# EAGLE design Super Lucky Multi FPC (EAGLE 5.01)
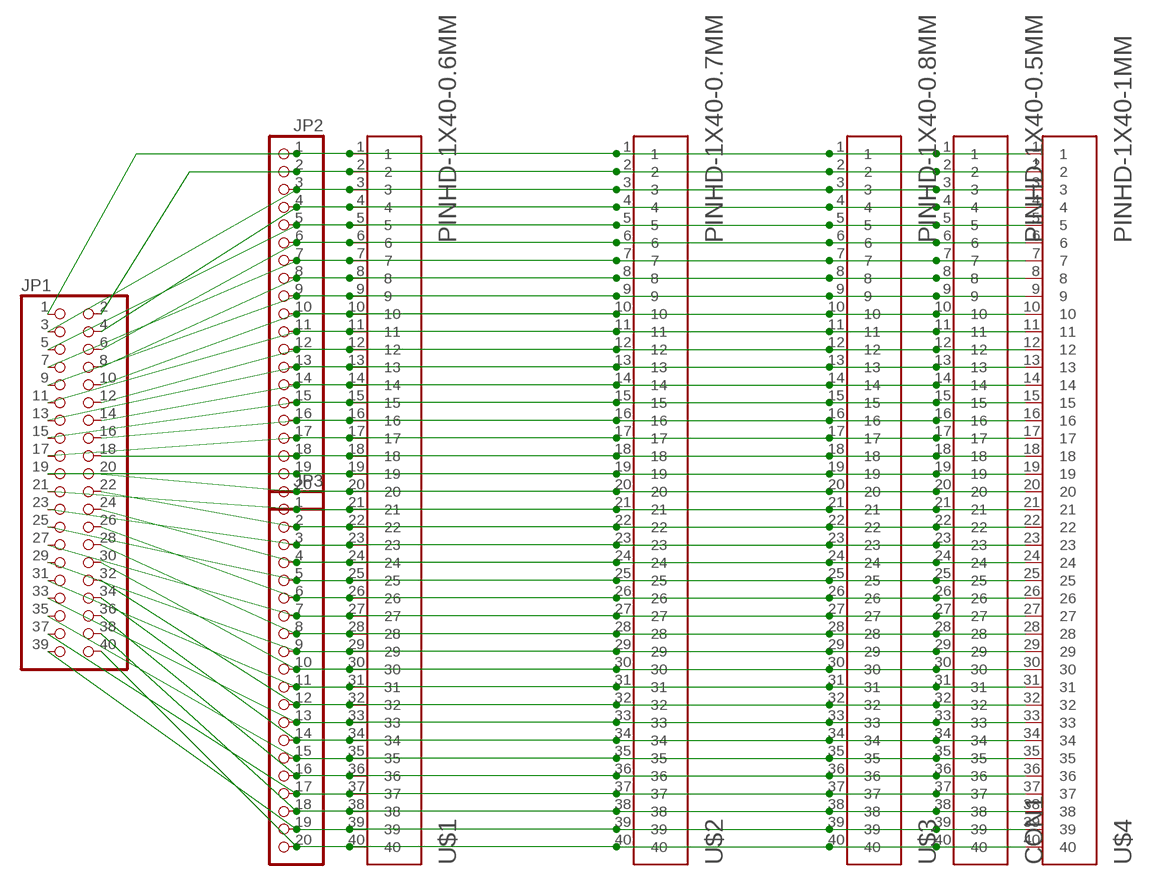
[diagram p0: schematic, sheet 1]

## Parts
CON1  PINHD-1X40-0.5MM  [1X40-0.5MM]
JP1  PINHD-2X20-BIG  [2X20-BIG]
JP2  PINHD-1X20-BIG  [1X20-BIG]
JP3  PINHD-1X20-BIG  [1X20-BIG]
U$1  PINHD-1X40-0.6MM  [1X40-0.6MM]
U$2  PINHD-1X40-0.7MM  [1X40-0.7MM]
U$3  PINHD-1X40-0.8MM  [1X40-0.8MM]
U$4  PINHD-1X40-1MM  [1X40-1MM]

## Nets
N$1: CON1.1 JP1.1 JP2.1 U$1.1 U$2.1 U$3.1 U$4.1
N$2: CON1.2 JP1.2 JP2.2 U$1.2 U$2.2 U$3.2 U$4.2
N$3: CON1.3 JP1.3 JP2.3 U$1.3 U$2.3 U$3.3 U$4.3
N$4: CON1.4 JP1.4 JP2.4 U$1.4 U$2.4 U$3.4 U$4.4
N$5: CON1.5 JP1.5 JP2.5 U$1.5 U$2.5 U$3.5 U$4.5
N$6: CON1.6 JP1.6 JP2.6 U$1.6 U$2.6 U$3.6 U$4.6
N$7: CON1.7 JP1.7 JP2.7 U$1.7 U$2.7 U$3.7 U$4.7
N$8: CON1.8 JP1.8 JP2.8 U$1.8 U$2.8 U$3.8 U$4.8
N$9: CON1.9 JP1.9 JP2.9 U$1.9 U$2.9 U$3.9 U$4.9
N$10: CON1.10 JP1.10 JP2.10 U$1.10 U$2.10 U$3.10 U$4.10
N$11: CON1.11 JP1.11 JP2.11 U$1.11 U$2.11 U$3.11 U$4.11
N$12: CON1.12 JP1.12 JP2.12 U$1.12 U$2.12 U$3.12 U$4.12
N$13: CON1.13 JP1.13 JP2.13 U$1.13 U$2.13 U$3.13 U$4.13
N$14: CON1.14 JP1.14 JP2.14 U$1.14 U$2.14 U$3.14 U$4.14
N$15: CON1.15 JP1.15 JP2.15 U$1.15 U$2.15 U$3.15 U$4.15
N$16: CON1.16 JP1.16 JP2.16 U$1.16 U$2.16 U$3.16 U$4.16
N$17: CON1.17 JP1.17 JP2.17 U$1.17 U$2.17 U$3.17 U$4.17
N$18: CON1.18 JP1.18 JP2.18 U$1.18 U$2.18 U$3.18 U$4.18
N$19: CON1.19 JP1.19 JP2.19 U$1.19 U$2.19 U$3.19 U$4.19
N$20: CON1.20 JP1.20 JP2.20 U$1.20 U$2.20 U$3.20 U$4.20
N$21: CON1.21 JP1.21 JP3.1 U$1.21 U$2.21 U$3.21 U$4.21
N$22: CON1.22 JP1.22 JP3.2 U$1.22 U$2.22 U$3.22 U$4.22
N$23: CON1.23 JP1.23 JP3.3 U$1.23 U$2.23 U$3.23 U$4.23
N$24: CON1.24 JP1.24 JP3.4 U$1.24 U$2.24 U$3.24 U$4.24
N$25: CON1.25 JP1.25 JP3.5 U$1.25 U$2.25 U$3.25 U$4.25
N$26: CON1.26 JP1.26 JP3.6 U$1.26 U$2.26 U$3.26 U$4.26
N$27: CON1.27 JP1.27 JP3.7 U$1.27 U$2.27 U$3.27 U$4.27
N$28: CON1.28 JP1.28 JP3.8 U$1.28 U$2.28 U$3.28 U$4.28
N$29: CON1.29 JP1.29 JP3.9 U$1.29 U$2.29 U$3.29 U$4.29
N$30: CON1.30 JP1.30 JP3.10 U$1.30 U$2.30 U$3.30 U$4.30
N$31: CON1.31 JP1.31 JP3.11 U$1.31 U$2.31 U$3.31 U$4.31
N$32: CON1.32 JP1.32 JP3.12 U$1.32 U$2.32 U$3.32 U$4.32
N$33: CON1.33 JP1.33 JP3.13 U$1.33 U$2.33 U$3.33 U$4.33
N$34: CON1.34 JP1.34 JP3.14 U$1.34 U$2.34 U$3.34 U$4.34
N$35: CON1.35 JP1.35 JP3.15 U$1.35 U$2.35 U$3.35 U$4.35
N$36: CON1.36 JP1.36 JP3.16 U$1.36 U$2.36 U$3.36 U$4.36
N$37: CON1.37 JP1.37 JP3.17 U$1.37 U$2.37 U$3.37 U$4.37
N$38: CON1.38 JP1.38 JP3.18 U$1.38 U$2.38 U$3.38 U$4.38
N$39: CON1.39 JP1.39 JP3.19 U$1.39 U$2.39 U$3.39 U$4.39
N$40: CON1.40 JP1.40 JP3.20 U$1.40 U$2.40 U$3.40 U$4.40

## Library data of the parts
CON1 U$1-U$4 = adafruit:PINHD-1X40: Pinouts for OLED/LCD displays with flex ribbons
JP1 = adafruit:PINHD-2X20: PIN HEADER
JP2 JP3 = adafruit:PINHD-1X20: PIN HEADER

## Board
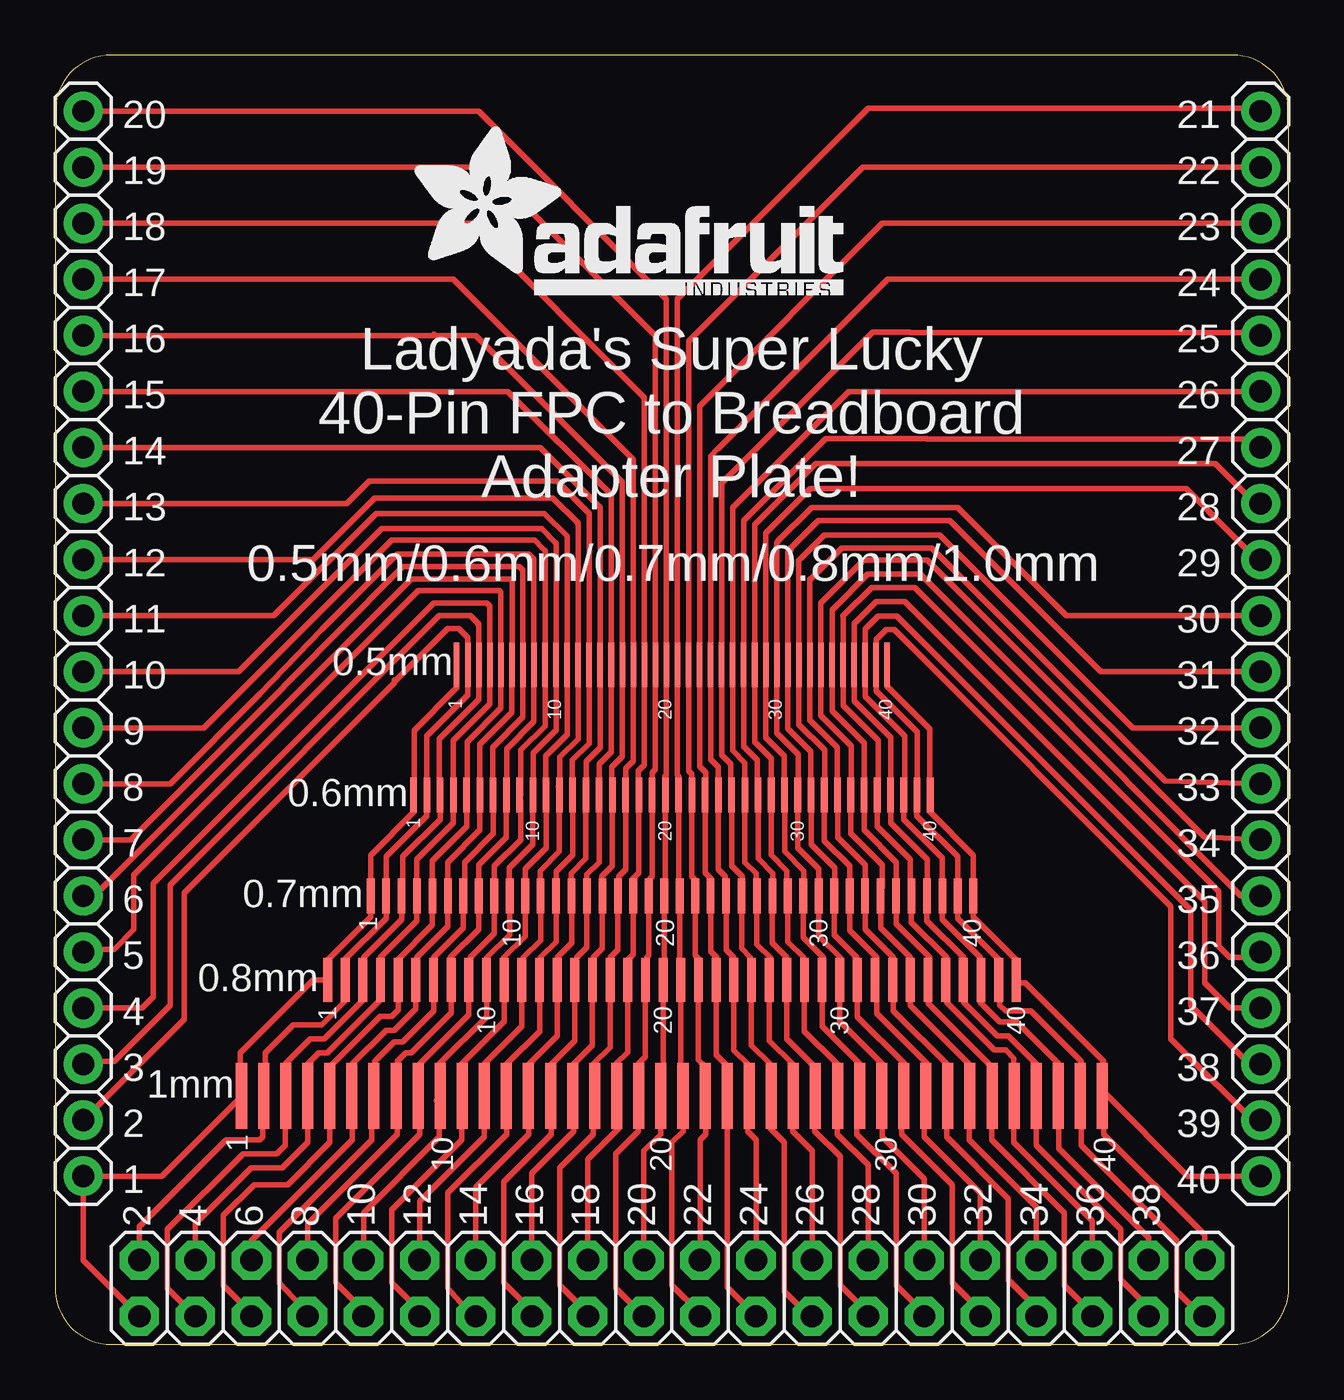
[diagram p1: board, top side]

Size 55.88 x 58.42 mm. Coordinates in mm from the lower left corner, seen from the top.
Outline: 0,55.88 0,2.54 arc90 2.54,0 53.34,0 arc90 55.88,2.54 55.88,55.88 arc90 53.34,58.42 2.54,58.42 arc90 0,55.88
Copper layers (1*16): Top 0.035mm / dielectric 1.5mm / Bottom 0.035mm
Design rules "default *": minimum track width 8mil, minimum drill 24mil, track to track 9mil, track to pad 8mil, pad to pad 8mil, via to via 8mil, smd to smd 8mil, copper to edge 10mil, drill to drill 8mil, minimum pad ring 10mil, minimum via ring 8mil, stop-mask expansion 4mil, vias tented up to drill 0mil, thermal gap 10mil

### Footprints (pad centres in the part's own frame; a part is rotated, then mirrored left to right if it is on the bottom)
1X40-0.5MM = smd 0.25 x 2: 1 -9.75,0; 2 -9.25,0; 3 -8.75,0; 4 -8.25,0; 5 -7.75,0; 6 -7.25,0; 7 -6.75,0; 8 -6.25,0; 9 -5.75,0; 10 -5.25,0; 11 -4.75,0; 12 -4.25,0; 13 -3.75,0; 14 -3.25,0; 15 -2.75,0; 16 -2.25,0; 17 -1.75,0; 18 -1.25,0; 19 -0.75,0; 20 -0.25,0; 21 0.25,0; 22 0.75,0; 23 1.25,0; 24 1.75,0; 25 2.25,0; 26 2.75,0; 27 3.25,0; 28 3.75,0; 29 4.25,0; 30 4.75,0; 31 5.25,0; 32 5.75,0; 33 6.25,0; 34 6.75,0; 35 7.25,0; 36 7.75,0; 37 8.25,0; 38 8.75,0; 39 9.25,0; 40 9.75,0
2X20-BIG = drill 1.016 pad 1.778 octagon: 1 -24.13,-1.27; 2 -24.13,1.27; 3 -21.59,-1.27; 4 -21.59,1.27; 5 -19.05,-1.27; 6 -19.05,1.27; 7 -16.51,-1.27; 8 -16.51,1.27; 9 -13.97,-1.27; 10 -13.97,1.27; 11 -11.43,-1.27; 12 -11.43,1.27; 13 -8.89,-1.27; 14 -8.89,1.27; 15 -6.35,-1.27; 16 -6.35,1.27; 17 -3.81,-1.27; 18 -3.81,1.27; 19 -1.27,-1.27; 20 -1.27,1.27; 21 1.27,-1.27; 22 1.27,1.27; 23 3.81,-1.27; 24 3.81,1.27; 25 6.35,-1.27; 26 6.35,1.27; 27 8.89,-1.27; 28 8.89,1.27; 29 11.43,-1.27; 30 11.43,1.27; 31 13.97,-1.27; 32 13.97,1.27; 33 16.51,-1.27; 34 16.51,1.27; 35 19.05,-1.27; 36 19.05,1.27; 37 21.59,-1.27; 38 21.59,1.27; 39 24.13,-1.27; 40 24.13,1.27
1X20-BIG = drill 1.016 pad 1.778: 1 -24.13,0; 2 -21.59,0; 3 -19.05,0; 4 -16.51,0; 5 -13.97,0; 6 -11.43,0; 7 -8.89,0; 8 -6.35,0; 9 -3.81,0; 10 -1.27,0; 11 1.27,0; 12 3.81,0; 13 6.35,0; 14 8.89,0; 15 11.43,0; 16 13.97,0; 17 16.51,0; 18 19.05,0; 19 21.59,0; 20 24.13,0
1X40-0.6MM = smd 0.3 x 1.6: 1 -11.7,0; 2 -11.1,0; 3 -10.5,0; 4 -9.9,0; 5 -9.3,0; 6 -8.7,0; 7 -8.1,0; 8 -7.5,0; 9 -6.9,0; 10 -6.3,0; 11 -5.7,0; 12 -5.1,0; 13 -4.5,0; 14 -3.9,0; 15 -3.3,0; 16 -2.7,0; 17 -2.1,0; 18 -1.5,0; 19 -0.9,0; 20 -0.3,0; 21 0.3,0; 22 0.9,0; 23 1.5,0; 24 2.1,0; 25 2.7,0; 26 3.3,0; 27 3.9,0; 28 4.5,0; 29 5.1,0; 30 5.7,0; 31 6.3,0; 32 6.9,0; 33 7.5,0; 34 8.1,0; 35 8.7,0; 36 9.3,0; 37 9.9,0; 38 10.5,0; 39 11.1,0; 40 11.7,0
1X40-0.7MM = smd 0.35 x 1.6: 1 -13.65,0; 2 -12.95,0; 3 -12.25,0; 4 -11.55,0; 5 -10.85,0; 6 -10.15,0; 7 -9.45,0; 8 -8.75,0; 9 -8.05,0; 10 -7.35,0; 11 -6.65,0; 12 -5.95,0; 13 -5.25,0; 14 -4.55,0; 15 -3.85,0; 16 -3.15,0; 17 -2.45,0; 18 -1.75,0; 19 -1.05,0; 20 -0.35,0; 21 0.35,0; 22 1.05,0; 23 1.75,0; 24 2.45,0; 25 3.15,0; 26 3.85,0; 27 4.55,0; 28 5.25,0; 29 5.95,0; 30 6.65,0; 31 7.35,0; 32 8.05,0; 33 8.75,0; 34 9.45,0; 35 10.15,0; 36 10.85,0; 37 11.55,0; 38 12.25,0; 39 12.95,0; 40 13.65,0
1X40-0.8MM = smd 0.4 x 2: 1 -15.6,0; 2 -14.8,0; 3 -14,0; 4 -13.2,0; 5 -12.4,0; 6 -11.6,0; 7 -10.8,0; 8 -10,0; 9 -9.2,0; 10 -8.4,0; 11 -7.6,0; 12 -6.8,0; 13 -6,0; 14 -5.2,0; 15 -4.4,0; 16 -3.6,0; 17 -2.8,0; 18 -2,0; 19 -1.2,0; 20 -0.4,0; 21 0.4,0; 22 1.2,0; 23 2,0; 24 2.8,0; 25 3.6,0; 26 4.4,0; 27 5.2,0; 28 6,0; 29 6.8,0; 30 7.6,0; 31 8.4,0; 32 9.2,0; 33 10,0; 34 10.8,0; 35 11.6,0; 36 12.4,0; 37 13.2,0; 38 14,0; 39 14.8,0; 40 15.6,0
1X40-1MM = smd 0.5 x 3: 1 -19.5,-0.17; 2 -18.5,-0.17; 3 -17.5,-0.17; 4 -16.5,-0.17; 5 -15.5,-0.17; 6 -14.5,-0.17; 7 -13.5,-0.17; 8 -12.5,-0.17; 9 -11.5,-0.17; 10 -10.5,-0.17; 11 -9.5,-0.17; 12 -8.5,-0.17; 13 -7.5,-0.17; 14 -6.5,-0.17; 15 -5.5,-0.17; 16 -4.5,-0.17; 17 -3.5,-0.17; 18 -2.5,-0.17; 19 -1.5,-0.17; 20 -0.5,-0.17; 21 0.5,-0.17; 22 1.5,-0.17; 23 2.5,-0.17; 24 3.5,-0.17; 25 4.5,-0.17; 26 5.5,-0.17; 27 6.5,-0.17; 28 7.5,-0.17; 29 8.5,-0.17; 30 9.5,-0.17; 31 10.5,-0.17; 32 11.5,-0.17; 33 12.5,-0.17; 34 13.5,-0.17; 35 14.5,-0.17; 36 15.5,-0.17; 37 16.5,-0.17; 38 17.5,-0.17; 39 18.5,-0.17; 40 19.5,-0.17

### Placement (x,y rotation side)
CON1  27.94,30.8 0 top
JP1  27.94,2.54 0 top
JP2  1.27,31.75 90 top
JP3  54.61,31.75 270 top
U$1  27.94,24.89 0 top
U$2  27.94,20.32 0 top
U$3  27.94,16.51 0 top
U$4  27.94,11.43 0 top
U$5  [ADAFRUIT_TEXT_20MM]  16.13,47.55 0 top

### Tracks (layer width: path | path; a pad name or v marks a point on that pad's centre or on a via)
N$1
  Top 0.254: U$2.1 14.29,19.37 12.32,17.4 12.32,16.64 12.34,16.62 U$3.1 11.68,16.51 8.38,13.21 8.38,11.18 | 16.24,24.11 U$1.1 16.26,24.91 16.26,27.81 18.11,29.67 | 14.29,20.01 U$2.1 | 8.38,11.18 8.38,11.05 8.44,11.11 U$4.1 8.44,11.23 8.38,11.18 | 16.24,24.11 16.26,24.13 | U$2.1 14.29,22.16 16.24,24.11 | 8.38,11.18 4.83,7.62 JP2.1 1.27,3.81 JP1.1 | 18.11,29.67 18.16,29.72 | CON1.1 18.19,29.75 18.11,29.67
N$2
  Top 0.254: 9.53,11.81 9.53,13.21 10.8,14.48 12.07,14.48 13.14,15.55 U$3.2 13.14,16.83 13.08,16.89 13.08,17.4 14.99,19.31 U$2.2 14.99,22.1 16.84,23.95 U$1.2 16.83,24.91 16.83,27.56 18.69,29.42 CON1.2 18.69,32.03 18.64,32.08 18.65,32.09 | 9.53,11.81 9.53,11.68 | JP1.2 3.81,5.33 7.75,9.27 9.27,9.27 9.4,9.4 9.4,11.3 | 9.4,11.3 | 9.4,11.3 U$4.2 | 9.53,11.81 9.4,11.81 9.4,11.3 | 15.4,30.07 17.78,32.45 18.29,32.45 18.65,32.09 | 15.4,30.07 15.37,30.04 | 18.65,32.09 18.67,32.07 | 18.65,32.09 | JP2.2 5.84,14.73 5.84,20.45 15.37,29.97 15.37,30.1 | 15.37,30.1 | 15.4,30.07 15.37,30.1
N$3
  Top 0.254: 13.94,16.48 13.84,16.38 | 13.94,16.48 U$3.3 13.94,15.59 12.19,13.84 11.56,13.84 10.41,12.7 10.41,11.29 | 13.94,16.48 13.97,16.51 13.97,17.53 15.69,19.25 U$2.3 15.75,20.32 15.75,22.1 17.44,23.79 U$1.3 17.4,24.93 17.4,27.43 19.19,29.22 CON1.3 19.19,32.6 19.15,32.64 19.18,32.64 18.8,33.02 17.4,33.02 5.21,20.83 5.21,15.37 2.67,12.83 1.4,12.83 JP2.3 | 10.44,11.28 U$4.3 10.41,11.29 | JP1.3 5.08,2.54 5.08,5.21 8.51,8.64 10.03,8.64 10.41,9.02 10.41,11.29 | 10.41,11.29 10.41,11.3
N$4
  Top 0.254: U$1.4 18.04,23.63 16.38,21.97 U$2.4 16.39,19.18 14.73,17.53 14.73,16.64 14.74,16.63 U$3.4 14.74,15.63 12.32,13.21 11.94,13.21 11.43,12.7 11.43,11.3 | 11.43,11.3 11.43,11.18 11.44,11.19 U$4.4 11.44,11.29 11.43,11.3 | 18.03,24.64 18.04,24.64 U$1.4 | JP1.4 6.35,5.46 8.89,8 10.29,8 11.43,9.14 11.43,11.3 | U$1.4 18.04,25.08 18.03,25.08 18.03,27.37 19.69,29.02 CON1.4 19.69,33.46 19.56,33.59 17.15,33.59 4.45,20.89 4.45,15.75 3.94,15.24 JP2.4
N$5
  Top 0.254: U$1.5 18.64,23.47 17.09,21.92 U$2.5 17.09,18.99 15.49,17.4 15.49,16.89 15.62,16.76 15.54,16.68 U$3.5 15.54,15.16 15.24,14.86 14.73,14.86 12.45,12.57 12.45,11.81 | 12.45,11.81 12.45,11.56 | 18.67,24.77 18.64,24.79 U$1.5 | JP1.5 8.89,1.4 7.62,2.67 7.62,5.84 9.02,7.24 10.54,7.24 12.45,9.14 U$4.5 | U$4.5 12.45,11.3 | U$4.5 12.44,11.8 12.45,11.81 | U$1.5 18.61,24.83 18.67,25.65 18.67,27.3 20.19,28.83 CON1.5 | CON1.5 20.19,30.61 | CON1.5 20.19,34.1 20.13,34.16 16.45,34.16 3.56,21.27 3.56,18.8 2.67,17.91 1.14,17.91 JP2.5
N$6
  Top 0.254: JP2.6 1.78,20.32 16.13,34.67 20.64,34.67 20.7,34.61 CON1.6 20.69,28.63 19.24,27.18 19.24,25.15 | JP1.6 8.89,4.7 13.46,9.27 13.46,11.18 13.38,11.26 | 13.38,11.26 13.34,11.3 | 13.38,11.26 U$4.6 13.44,11.32 13.34,11.43 13.46,11.56 13.46,12.7 14.99,14.22 15.37,14.22 16.34,15.2 U$3.6 16.34,16.59 16.38,16.64 16.38,17.53 17.79,18.93 U$2.6 17.79,20.69 17.78,20.7 17.78,21.84 19.24,23.3 U$1.6 19.24,25.15 | 19.24,25.15
N$7
  Top 0.254: U$3.7 | U$3.7 17.15,17.53 18.49,18.87 U$2.7 18.49,20.52 18.54,20.57 18.54,21.84 19.84,23.14 U$1.7 19.81,24.92 19.81,27.05 21.19,28.43 CON1.7 21.19,35.1 21.03,35.26 15.8,35.26 15.79,35.24 15.75,35.24 12.64,32.13 9.59,29.02 3.43,22.86 JP2.7 | U$3.7 17.15,15.11 15.75,13.72 15.37,13.72 14.48,12.83 14.48,11.56 | 14.48,11.56 14.48,11.05 14.44,11.09 U$4.7 14.44,11.52 14.48,11.56 | JP1.7 11.43,1.4 10.16,2.79 10.16,5.08 14.35,9.27 14.35,11.43 14.48,11.56
N$8
  Top 0.254: 20.44,24.26 20.44,22.98 19.18,21.72 19.18,20.45 19.19,20.43 U$2.8 19.19,18.81 17.91,17.53 17.91,16.76 17.94,16.73 U$3.8 17.94,15.02 16.13,13.21 15.88,13.21 15.49,12.83 15.49,11.56 15.37,11.43 15.44,11.36 U$4.8 15.41,11.26 | U$1.8 20.44,24.26 | JP2.8 5.21,25.4 9.27,29.46 12.07,32.38 15.49,35.81 21.46,35.81 21.59,35.69 21.69,35.59 CON1.8 21.69,28.23 20.45,26.99 U$1.8 | 20.44,24.26 20.45,24.26 | JP1.8 11.43,5.46 15.49,9.53 15.49,11.18 15.41,11.26 | 15.41,11.26 15.37,11.3 | 20.45,24.83 U$1.8
N$9
  Top 0.254: U$1.9 21.04,24.68 21.08,24.64 21.08,22.86 19.89,21.67 U$2.9 19.89,18.62 18.8,17.53 18.8,16.51 U$3.9 18.74,14.93 16.51,12.7 16.51,11.56 16.38,11.43 16.44,11.37 U$4.9 16.47,11.26 16.51,11.3 16.51,9.53 12.7,5.71 12.7,2.79 13.97,1.52 JP1.9 | U$1.9 21.08,24.89 | U$1.9 21.04,24.91 21.08,24.95 21.08,26.92 22.19,28.03 CON1.9 22.19,35.98 22.07,36.09 21.72,36.45 15.24,36.45 6.73,27.94 JP2.9
N$10
  Top 0.254: JP1.10 13.97,5.97 17.4,9.4 17.4,10.92 17.27,11.05 17.44,11.22 U$4.10 17.44,11.34 17.53,11.43 17.4,11.56 17.4,12.7 19.54,14.84 U$3.10 19.54,16.87 19.56,16.89 19.56,17.53 20.59,18.56 U$2.10 20.59,20.43 20.57,20.45 20.57,21.59 21.64,22.66 U$1.10 21.64,24.94 21.65,24.95 21.65,26.8 22.69,27.83 CON1.10 22.69,36.29 22.63,36.35 22.64,36.35 | JP2.10 8.32,30.48 14.8,36.96 22.04,36.96 22.64,36.35 | 22.64,36.35 22.67,36.32 | 22.64,36.35
N$11
  Top 0.254: 0.76,33.02 JP2.11 9.91,33.02 14.54,37.66 22.16,37.66 23.18,36.64 23.16,36.63 23.19,36.6 CON1.11 23.19,27.63 22.23,26.67 22.23,24.91 U$1.11 22.24,22.49 21.29,21.54 U$2.11 21.29,18.5 20.32,17.53 20.32,16.53 U$3.11 20.34,14.62 18.41,12.7 18.41,11.18 18.44,11.2 U$4.11 18.44,10.95 18.41,10.92 18.41,9.27 15.24,6.1 15.24,2.79 16.51,1.52 JP1.11
N$12
  Top 0.254: JP2.12 1.27,35.43 1.4,35.31 1.65,35.56 11.68,35.56 14.48,38.35 22.54,38.35 23.69,37.21 23.65,37.21 23.69,37.17 23.69,30.86 CON1.12 23.69,27.44 22.86,26.61 22.86,25.34 22.8,25.27 22.84,25.23 U$1.12 22.84,22.33 21.97,21.46 21.97,20.32 U$2.12 21.99,18.31 21.21,17.53 21.21,16.76 21.14,16.7 U$3.12 21.14,14.41 19.43,12.7 19.43,11.56 19.44,11.55 U$4.12 19.44,11.19 19.3,11.05 19.43,10.92 19.43,9.4 16.51,6.48 JP1.12
N$13
  Top 0.254: JP2.13 1.4,38.1 1.52,38.23 1.65,38.1 13.21,38.1 14.22,39.12 22.73,39.12 24.19,37.66 24.19,30.73 24.19,30.74 CON1.13 24.19,27.24 23.43,26.48 23.43,25.02 23.44,25.01 U$1.13 23.44,22.17 22.69,21.42 U$2.13 22.69,18.24 21.97,17.53 21.97,16.76 21.94,16.73 U$3.13 21.94,14.19 20.45,12.7 20.45,11.18 20.44,11.18 U$4.13 20.44,11.06 20.45,11.05 20.45,9.53 17.78,6.86 17.78,2.54 18.92,1.27 JP1.13
N$14
  Top 0.254: 1.27,40.39 1.14,40.26 | 1.27,40.39 JP2.14 | 1.27,40.39 1.52,40.64 21.97,40.64 24.7,37.91 24.7,30.86 24.69,30.85 CON1.14 24.69,27.04 24.07,26.42 24.07,24.92 U$1.14 24.04,22.01 23.37,21.34 23.37,20.7 23.39,20.68 U$2.14 23.39,18.18 22.73,17.53 22.73,16.64 22.74,16.63 U$3.14 22.74,13.98 21.34,12.57 21.34,11.05 21.44,11.15 U$4.14 21.44,10.9 21.34,10.79 21.46,10.67 21.46,9.53 19.05,7.11 JP1.14
N$15
  Top 0.254: 1.02,43.18 JP2.15 | 1.02,43.18 0.89,43.05 | JP1.15 21.59,1.52 20.32,2.79 20.32,7.37 22.48,9.53 22.48,10.92 22.35,11.05 22.44,11.14 U$4.15 22.48,11.3 22.35,11.43 22.35,12.57 23.54,13.76 U$3.15 23.5,16.51 23.62,16.64 23.62,17.53 24.09,17.99 U$2.15 24.09,21.3 24.64,21.85 U$1.15 24.64,24.95 24.64,26.29 25.19,26.84 CON1.15 25.19,38.5 20.51,43.18 1.02,43.18
N$16
  Top 0.254: JP2.16 1.4,45.72 1.52,45.85 1.65,45.72 17.15,45.72 17.15,45.78 17.21,45.72 19.05,45.72 25.69,39.08 CON1.16 25.69,26.64 25.21,26.16 25.21,25.21 25.27,25.15 25.24,25.11 U$1.16 25.24,21.68 24.77,21.21 24.77,20.57 24.79,20.55 U$2.16 24.79,17.93 24.38,17.53 24.38,16.64 24.34,16.59 U$3.16 24.34,13.54 23.5,12.7 23.5,11.3 23.45,11.26 U$4.16 23.44,11.23 23.5,11.18 23.5,9.65 21.59,7.75 JP1.16
N$17
  Top 0.254: 24.38,11.3 24.38,11.18 24.44,11.23 U$4.17 24.43,11.26 24.38,11.3 | 24.38,11.3 24.38,12.7 25.14,13.46 U$3.17 25.14,16.63 25.15,16.64 25.15,17.53 25.49,17.87 U$2.17 25.49,20.41 25.53,20.45 25.53,21.21 25.84,21.52 U$1.17 25.85,26.1 26.19,26.44 CON1.17 26.19,40.1 18.03,48.26 1.65,48.26 1.27,47.88 JP2.17 | JP1.17 24.13,1.4 22.86,2.67 22.86,8 24.38,9.53 24.38,11.3
N$18
  Top 0.254: JP2.18 1.4,50.93 1.52,50.8 18.8,50.8 26.69,42.91 CON1.18 26.69,26.25 26.42,25.97 26.42,25.15 26.44,25.12 U$1.18 26.44,21.36 26.16,21.08 26.16,20.19 26.19,20.22 U$2.18 26.19,17.68 25.91,17.4 25.91,16.38 25.94,16.41 U$3.18 25.94,13.24 25.4,12.7 25.4,11.68 25.44,11.64 U$4.18 25.44,11.09 25.4,11.05 25.53,10.92 25.53,9.78 24.13,8.38 JP1.18
N$19
  Top 0.254: 26.42,11.43 26.42,10.92 26.44,10.95 U$4.19 26.44,11.41 26.42,11.43 | 26.42,11.43 26.42,12.7 26.74,13.02 U$3.19 26.74,16.71 26.8,16.76 26.8,17.53 26.89,17.62 U$2.19 26.89,20.54 26.92,20.57 26.92,21.08 27.04,21.2 U$1.19 27.05,24.9 27.05,25.91 27.19,26.05 CON1.19 27.19,45.71 19.56,53.34 JP2.19 1.02,53.59 | JP1.19 25.4,2.54 25.4,8.64 26.42,9.65 26.42,11.43
N$20
  Top 0.254: 27.43,11.18 27.43,12.19 27.54,12.3 U$3.20 27.54,16.74 27.59,16.8 U$2.20 27.59,20.67 27.56,20.7 27.64,20.78 U$1.20 27.64,25.13 27.62,25.15 27.62,25.73 27.69,25.8 CON1.20 27.69,47.37 27.62,47.43 | JP2.20 1.52,56.13 1.78,55.88 19.18,55.88 27.62,47.43 | JP1.20 26.67,8.76 27.43,9.53 27.43,11.18 | 27.43,11.18 27.44,11.18 U$4.20 | 27.62,47.43 27.64,47.42
N$21
  Top 0.254: 28.32,47.5 28.24,47.42 | 28.32,47.5 36.83,56.01 54.36,56.01 54.48,56.13 54.61,56.01 JP3.1 | JP1.21 29.21,1.4 27.94,2.67 27.94,9.14 28.45,9.65 28.45,10.92 28.32,11.05 28.44,11.17 U$4.21 28.44,11.55 28.45,11.56 28.34,11.66 U$3.21 28.29,16.51 U$2.21 28.29,20.67 28.32,20.7 28.24,20.78 U$1.21 28.24,24.91 28.19,24.95 28.26,25.02 28.26,25.73 28.19,25.8 CON1.21 28.19,47.37 28.32,47.5
N$22
  Top 0.254: 28.85,45.62 36.58,53.34 JP3.2 54.86,53.34 | 54.86,53.34 55.12,53.34 55.25,53.47 54.99,53.47 54.86,53.34 | JP1.22 29.21,9.27 29.46,9.53 29.46,10.79 29.34,10.92 29.44,11.03 U$4.22 29.44,11.41 29.46,11.43 29.46,12.57 29.14,12.9 U$3.22 29.14,16.57 29.21,16.64 29.21,17.4 28.99,17.62 U$2.22 28.99,20.54 28.96,20.57 28.96,21.08 28.84,21.2 U$1.22 28.84,25.33 28.83,25.34 28.83,25.84 28.69,25.98 CON1.22 28.69,45.45 28.85,45.62 | 28.85,45.62 28.84,45.6
N$23
  Top 0.254: U$4.23 30.48,11.3 30.48,12.57 29.94,13.11 U$3.23 29.94,16.73 29.97,16.76 29.97,17.53 29.69,17.81 U$2.23 29.72,20.32 29.72,21.08 29.44,21.36 U$1.23 29.46,24.92 29.46,25.91 29.19,26.18 CON1.23 29.19,42.52 37.47,50.8 JP3.3 54.74,50.8 | U$4.23 | 54.74,50.8 54.74,50.67 54.86,50.67 54.74,50.8 | U$4.23 30.44,2.58 JP1.23
N$24
  Top 0.254: JP3.4 37.72,48.26 30.04,40.58 30.02,40.58 29.69,40.26 CON1.24 29.69,26.51 30.04,26.16 30.04,25.02 30.04,25.01 U$1.24 30.04,21.52 30.35,21.21 30.35,20.7 30.39,20.66 U$2.24 30.39,17.87 30.73,17.53 30.73,16.64 30.74,16.63 U$3.24 30.74,13.33 31.37,12.7 31.37,11.3 31.41,11.26 U$4.24 31.44,11.25 31.37,11.18 31.37,9.65 31.75,9.27 JP1.24 | JP3.4 54.74,48.26 55.25,47.75 54.61,47.75 54.48,47.88 54.61,48.01 JP3.4
N$25
  Top 0.254: JP3.5 54.48,45.59 54.23,45.85 38.73,45.85 38.71,45.87 37.03,45.87 30.19,39.03 CON1.25 30.19,26.71 30.61,26.29 30.61,24.89 U$1.25 30.64,21.68 31.12,21.21 31.12,20.34 U$2.25 31.09,17.93 31.5,17.53 31.5,16.76 31.54,16.72 U$3.25 31.54,13.54 32.39,12.7 32.39,11.18 32.44,11.23 U$4.25 32.44,10.98 32.39,10.92 32.39,9.78 33.02,9.14 33.02,2.41 34.16,1.27 JP1.25
N$26
  Top 0.254: 33.4,11.56 33.4,11.43 33.53,11.3 33.48,11.26 U$4.26 33.44,11.52 33.4,11.56 | 33.4,11.56 33.4,12.7 32.34,13.76 U$3.26 32.34,16.59 32.39,16.64 32.39,17.53 31.79,18.12 U$2.26 31.79,20.53 31.75,20.57 31.75,21.34 31.24,21.85 U$1.26 31.24,25.02 31.24,26.35 30.69,26.91 CON1.26 30.69,37.93 35.94,43.18 39.6,43.18 | 54.74,43.18 JP3.6 39.6,43.18 | 39.6,43.18 39.37,43.18 | JP1.26 34.29,8.76 33.4,9.65 33.4,11.56
N$27
  Top 0.254: U$1.27 31.84,22.01 32.51,21.34 32.51,20.34 U$2.27 32.49,18.18 33.15,17.53 33.15,16.64 33.14,16.63 U$3.27 33.14,13.85 34.42,12.57 34.42,11.3 34.46,11.26 | 34.46,11.26 34.54,11.18 | 34.46,11.26 U$4.27 34.44,11.07 34.29,10.92 34.42,10.79 34.42,9.65 35.56,8.51 35.56,2.67 36.83,1.4 JP1.27 | JP3.7 54.23,41.02 39.5,41.02 39.47,41.05 34.9,41.05 31.19,37.34 CON1.27 31.19,27.1 31.81,26.48 31.81,24.89 U$1.27 | JP3.7 54.99,40.26 54.99,40.39 54.61,40.77 JP3.7 | U$1.27 31.84,24.98
N$28
  Top 0.254: 35.39,11.26 35.31,11.18 | 35.39,11.26 U$4.28 35.44,11.06 35.31,10.92 35.43,10.79 35.43,9.53 36.83,8.13 JP1.28 | 35.39,11.26 35.43,11.3 35.43,12.7 33.94,14.19 U$3.28 33.94,16.86 33.91,16.89 33.91,17.53 33.19,18.24 U$2.28 33.15,20.36 33.15,21.46 32.44,22.17 U$1.28 32.45,26.54 31.69,27.3 CON1.28 31.69,37.15 34.44,39.9 52.55,39.9 54.46,38 54.56,38.1 JP3.8 | 53.85,38.23 54.1,37.97 54.61,37.97 JP3.8 | JP3.8 54.61,37.95 54.59,37.92 54.05,38.46
N$29
  Top 0.254: 54.23,35.56 54.36,35.43 54.48,35.56 JP3.9 54.61,35.48 54.56,35.43 52.46,37.53 | JP1.29 39.37,1.4 38.1,2.67 38.1,7.75 36.32,9.53 36.32,11.05 36.44,11.17 U$4.29 36.53,11.26 36.58,11.3 36.45,11.43 36.45,12.7 34.74,14.41 U$3.29 34.74,16.58 34.8,16.64 34.8,17.53 33.89,18.43 U$2.29 33.89,20.55 33.91,20.57 33.91,21.46 33.04,22.33 U$1.29 33.02,24.91 33.02,26.67 32.19,27.5 CON1.29 32.19,36.76 34.21,38.79 51.23,38.79 52.48,37.54 52.46,37.53 | 52.46,37.53 52.22,37.77
N$30
  Top 0.254: 54.99,33.02 JP3.10 45.8,33.02 40.89,37.92 34.27,37.92 32.74,36.4 32.77,36.4 32.69,36.32 CON1.30 32.69,27.7 33.66,26.73 33.66,24.95 33.64,24.94 U$1.30 33.64,22.49 34.59,21.54 U$2.30 34.59,18.5 35.56,17.53 35.56,16.64 35.54,16.62 U$3.30 35.54,14.62 37.47,12.7 37.47,11.18 37.44,11.2 U$4.30 37.44,11.02 37.34,10.92 37.47,10.79 37.47,9.4 39.37,7.49 JP1.30
N$31
  Top 0.254: U$1.31 34.24,22.66 35.31,21.59 35.31,20.7 35.29,20.69 U$2.31 35.29,18.56 36.32,17.53 36.32,16.51 U$3.31 36.34,14.84 38.48,12.7 38.48,11.68 | 38.44,11.01 38.35,10.92 | 38.44,11.01 U$4.31 38.44,11.64 38.48,11.68 | 38.48,11.68 38.48,11.05 38.44,11.01 | U$1.31 34.24,24.97 | JP1.31 41.91,1.52 40.64,2.79 40.64,7.24 38.35,9.53 38.35,11.56 38.48,11.68 | U$1.31 34.24,24.94 34.23,24.95 34.23,26.86 33.19,27.9 CON1.31 33.19,35.88 33.35,36.04 33.31,36.08 | JP3.11 47.37,30.48 40.51,37.34 34.57,37.34 33.31,36.08 | 33.31,36.08 33.22,35.99
N$32
  Top 0.254: 37.21,16.51 U$3.32 | 37.21,16.51 37.21,17.53 35.99,18.75 U$2.32 35.99,21.67 34.84,22.82 U$1.32 34.86,24.91 34.86,26.92 33.69,28.09 CON1.32 33.69,35.54 33.83,35.69 33.84,35.67 | 37.21,16.51 37.21,14.99 39.5,12.7 39.5,11.43 | 39.37,11.3 39.41,11.26 U$4.32 39.44,11.37 39.5,11.43 | JP1.32 41.91,6.86 39.37,9.4 39.37,11.3 | 39.37,11.3 39.5,11.43 | JP3.12 48.82,27.94 40.08,36.68 34.85,36.68 33.84,35.67 | 33.84,35.67 33.78,35.61
N$33
  Top 0.254: 37.97,16.51 U$3.33 | 37.97,16.51 37.97,17.53 36.69,18.81 U$2.33 36.7,20.32 36.7,21.72 35.44,22.98 U$1.33 35.43,27.05 34.19,28.29 CON1.33 | 37.97,16.51 37.97,15.11 40.51,12.57 40.51,10.79 40.44,10.87 U$4.33 40.44,10.98 40.39,10.92 40.39,9.4 43.18,6.6 43.18,2.92 44.45,1.65 JP1.33 | JP3.13 50.29,25.53 49.28,26.54 45.97,29.82 39.7,36.09 35.64,36.09 34.28,34.73 | CON1.33 | 34.28,34.73 34.19,34.65 | 34.28,34.73 34.27,34.75 34.19,34.67 CON1.33
N$34
  Top 0.254: U$1.34 36.04,23.14 37.47,21.72 37.47,20.7 37.34,20.57 37.39,20.52 U$2.34 37.39,18.87 38.73,17.53 U$3.34 | U$3.34 | U$3.34 38.73,15.37 41.53,12.57 41.53,11.56 41.4,11.43 41.44,11.39 U$4.34 41.44,11.34 | 36.07,24.77 36.04,24.79 U$1.34 | JP1.34 44.45,6.22 41.4,9.27 41.4,11.3 41.44,11.34 | 41.44,11.34 41.53,11.43 | U$1.34 36.07,24.89 36.07,27.12 34.69,28.49 CON1.34 34.69,33.6 34.75,33.66 | JP3.14 52.05,22.99 39.5,35.53 36.63,35.53 34.75,33.66 | 34.75,33.66 34.72,33.63
N$35
  Top 0.254: U$1.35 36.64,23.3 38.1,21.84 U$2.35 38.09,19.06 39.62,17.53 39.62,16.64 39.54,16.55 U$3.35 39.54,15.45 42.42,12.57 42.42,11.56 | 42.42,11.56 42.42,11.18 42.44,11.2 U$4.35 42.44,11.54 42.42,11.56 | U$1.35 36.64,24.83 | JP1.35 46.99,1.4 45.72,2.67 45.72,5.97 42.42,9.27 42.42,11.56 | U$1.35 | U$1.35 36.64,27.24 35.19,28.69 CON1.35 35.19,33.28 35.28,33.38 | JP3.15 53.7,20.32 52.22,21.79 44.86,29.23 39.19,34.9 36.8,34.9 35.28,33.38 | 35.28,33.38 35.26,33.35
N$36
  Top 0.254: 40.39,16.51 U$3.36 | 40.39,16.51 40.39,17.53 38.79,19.12 U$2.36 38.79,20.65 38.73,20.7 38.73,21.97 37.24,23.47 U$1.36 37.24,24.86 | 40.39,16.51 40.39,15.49 42.55,13.34 43.05,13.34 43.43,12.95 43.43,11.43 | 43.43,11.43 43.31,11.3 43.35,11.26 U$4.36 43.44,11.42 43.43,11.43 | JP1.36 46.99,5.59 43.43,9.14 43.43,11.43 | 37.24,24.86 37.21,24.83 | 37.24,24.86 37.28,24.89 37.28,27.37 35.69,28.95 CON1.36 35.69,32.99 36.98,34.29 38.94,34.29 52.7,20.52 52.7,18.03 53.21,17.53 54.48,17.53 54.48,17.65 JP3.16
N$37
  Top 0.254: U$1.37 37.84,23.63 39.5,21.97 39.5,20.45 39.49,20.44 U$2.37 39.49,19.18 41.15,17.53 41.15,16.38 | 41.15,16.38 41.14,16.39 U$3.37 | 41.15,16.38 41.15,15.49 42.67,13.97 43.18,13.97 44.45,12.7 44.45,11.43 44.44,11.42 U$4.37 44.44,11.19 44.45,11.18 44.45,9.02 48.26,5.21 48.26,2.92 49.53,1.65 JP1.37 | U$1.37 37.84,24.76 37.85,24.77 | U$1.37 37.84,25.01 37.85,25.02 37.85,27.5 36.19,29.15 CON1.37 36.19,32.66 37.19,33.66 38.48,33.66 52.07,20.07 52.07,16.38 53.21,15.24 JP3.17
N$38
  Top 0.254: 41.91,16.38 41.94,16.41 U$3.38 | 41.91,16.38 41.91,17.53 40.19,19.25 U$2.38 40.19,22.04 38.44,23.79 U$1.38 38.44,24.91 38.48,24.95 38.48,27.56 36.69,29.35 CON1.38 36.69,32.4 36.73,32.44 | 41.91,16.38 41.91,15.49 42.8,14.61 43.56,14.61 45.47,12.7 45.47,11.18 45.44,11.2 U$4.38 45.44,11.07 45.47,11.05 45.47,8.89 49.53,4.83 JP1.38 | 36.73,32.44 37.29,32.99 38.12,32.99 51.44,19.69 51.44,15.37 54.1,12.7 JP3.18 54.86,12.7 | 36.73,32.44 36.7,32.41
N$39
  Top 0.254: 42.8,16.51 U$3.39 | 42.8,16.51 42.8,17.4 40.89,19.31 U$2.39 40.89,22.1 39.04,23.95 U$1.39 39.05,24.91 39.05,27.75 37.19,29.61 CON1.39 | 42.8,16.51 42.8,15.37 43.05,15.11 44.2,15.11 46.48,12.83 46.48,11.56 46.44,11.52 U$4.39 46.44,11.09 46.48,11.05 46.48,9.02 50.8,4.7 50.8,2.41 51.94,1.27 JP1.39 | CON1.39 37.17,30.8 | CON1.39 37.19,31.93 37.64,32.38 38,32.38 50.55,19.84 50.55,13.84 54.74,9.65 54.74,10.03 JP3.19
N$40
  Top 0.254: 39.64,24.11 U$1.40 39.62,24.89 39.62,27.88 37.69,29.81 CON1.40 | 43.56,16.38 43.54,16.4 U$3.40 | 43.56,16.38 43.56,17.4 41.59,19.37 U$2.40 41.59,22.16 39.64,24.11 | 39.64,24.11 39.62,24.13 | 43.56,16.38 43.94,16.38 47.5,12.83 47.5,11.43 | 47.5,11.18 47.5,11.43 | 47.5,11.43 47.44,11.37 U$4.40 47.44,11.23 47.5,11.18 | JP3.20 51.31,7.62 47.5,11.43 | JP1.40 52.07,4.95 47.5,9.53 47.5,11.18

### Text on the board
tPlace: 20 | 21 | 19 | 22 | 18 | 23 | 17 | 24 | 16 | 25 | 15 | 26 | Ladyada's Super Lucky / 40-Pin FPC to Breadboard / Adapter Plate! | 14 | 27 | 13 | 28 | 12 | 0.5mm/0.6mm/0.7mm/0.8mm/1.0mm | 29 | 11 | 0.5mm | 30 | 10 | 31 | 9 | 32 | 0.6mm | 8 | 33 | 7 | 34 | 0.7mm | 6 | 35 | 5 | 0.8mm | 36 | 4 | 37 | 3 | 1mm | 38 | 2 | 39 | 1 | 40 | 2 | 4 | 6 | 8 | 10 | 12 | 14 | 16 | 18 | 20 | 22 | 24 | 26 | 28 | 30 | 32 | 34 | 36 | 38